# EAGLE design Schematic (EAGLE 9.6.2)
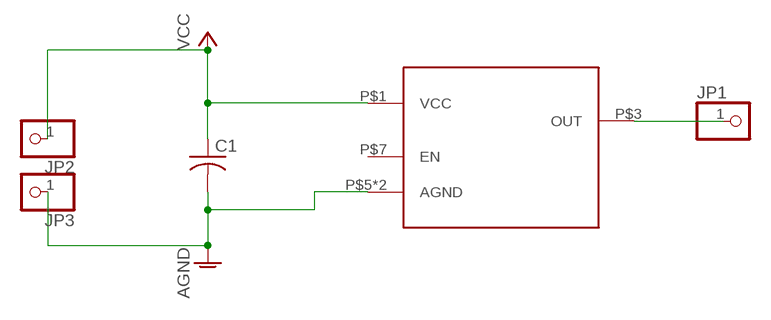
[diagram p0: schematic, sheet 1]

## Parts
C1  C-USC0805  [C0805]
JP1  PINHD-1X1  [1X01]
JP2  PINHD-1X1  [1X01]
JP3  PINHD-1X1  [1X01]
U$1  MLX92213  [MLX92213]

## Nets
AGND: C1.2 JP3.1 U$1.P$5(AGND) U$1.P$8(AGND)
N$2: JP1.1 U$1.P$3(OUT)
VCC: C1.1 JP2.1 U$1.P$1(VCC)
Unconnected: U$1.P$7(EN)

## Library data of the parts
C1 = rcl:C-US: CAPACITOR, American symbol; SPICEPREFIX: C
JP1-JP3 = pinhead:PINHD-1X1: PIN HEADER
U$1 = MLX92213:MLX92213

## Board
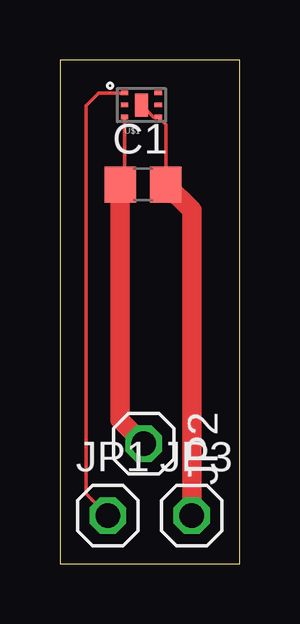
[diagram p1: board, top side]

Size 7.5 x 21 mm. Coordinates in mm from the lower left corner, seen from the top.
Outline: 0,0 7.5,0 7.5,21 0,21 0,0
Copper layers (1*16): Top 0.035mm / dielectric 1.5mm / Bottom 0.035mm
Design rules "default": minimum track width 6mil, minimum drill 0.35mm, track to track 6mil, track to pad 6mil, pad to pad 6mil, via to via 6mil, smd to smd 6mil, copper to edge 40mil, drill to drill 6mil, minimum pad ring 10mil, minimum via ring 8mil, stop-mask expansion 4mil, vias tented up to drill 0mil, thermal gap 10mil

### Footprints (pad centres in the part's own frame; a part is rotated, then mirrored left to right if it is on the bottom)
C0805 = smd 1.3 x 1.5: 1 -0.95,0; 2 0.95,0
1X01 = drill 1.016 octagon: 1 0,0
MLX92213 = smd 0.3 x 0.18: P$1 0,0; P$2 0,0.5; P$3 0,1; P$5 1.4,0; P$6 1.4,0.5; P$7 1.4,1 | smd 0.55 x 0.95: P$8 0.7,0.5

### Placement (x,y rotation side)
C1  3.47,15.81 0 top
JP1  2,2 0 top
JP2  3.5,5 270 top
JP3  5.5,2 0 top
U$1  2.7,18.62 0 top

### Tracks (layer width: path | path; a pad name or v marks a point on that pad's centre or on a via)
AGND
  Top 0.152: U$1.P$8 3.9,18.62 U$1.P$5 4.42,18.3 C1.2
  Top 0.813: C1.2 5.5,14.73 JP3.1
N$2
  Top 0.152: JP1.1 1.1,2.9 1.1,19.1 1.62,19.62 U$1.P$3
VCC
  Top 0.152: U$1.P$1 2.7,15.99 C1.1 2.52,15.5
  Top 0.813: JP2.1 2.52,5.98 2.52,15.5